# Altium project UZ_CarrierBoard.PrjPcb (part 9 of 10)

## Sheet I2C_Subsystems.SchDoc
size A4; Organization: UltraZohm; SheetNumber: 14
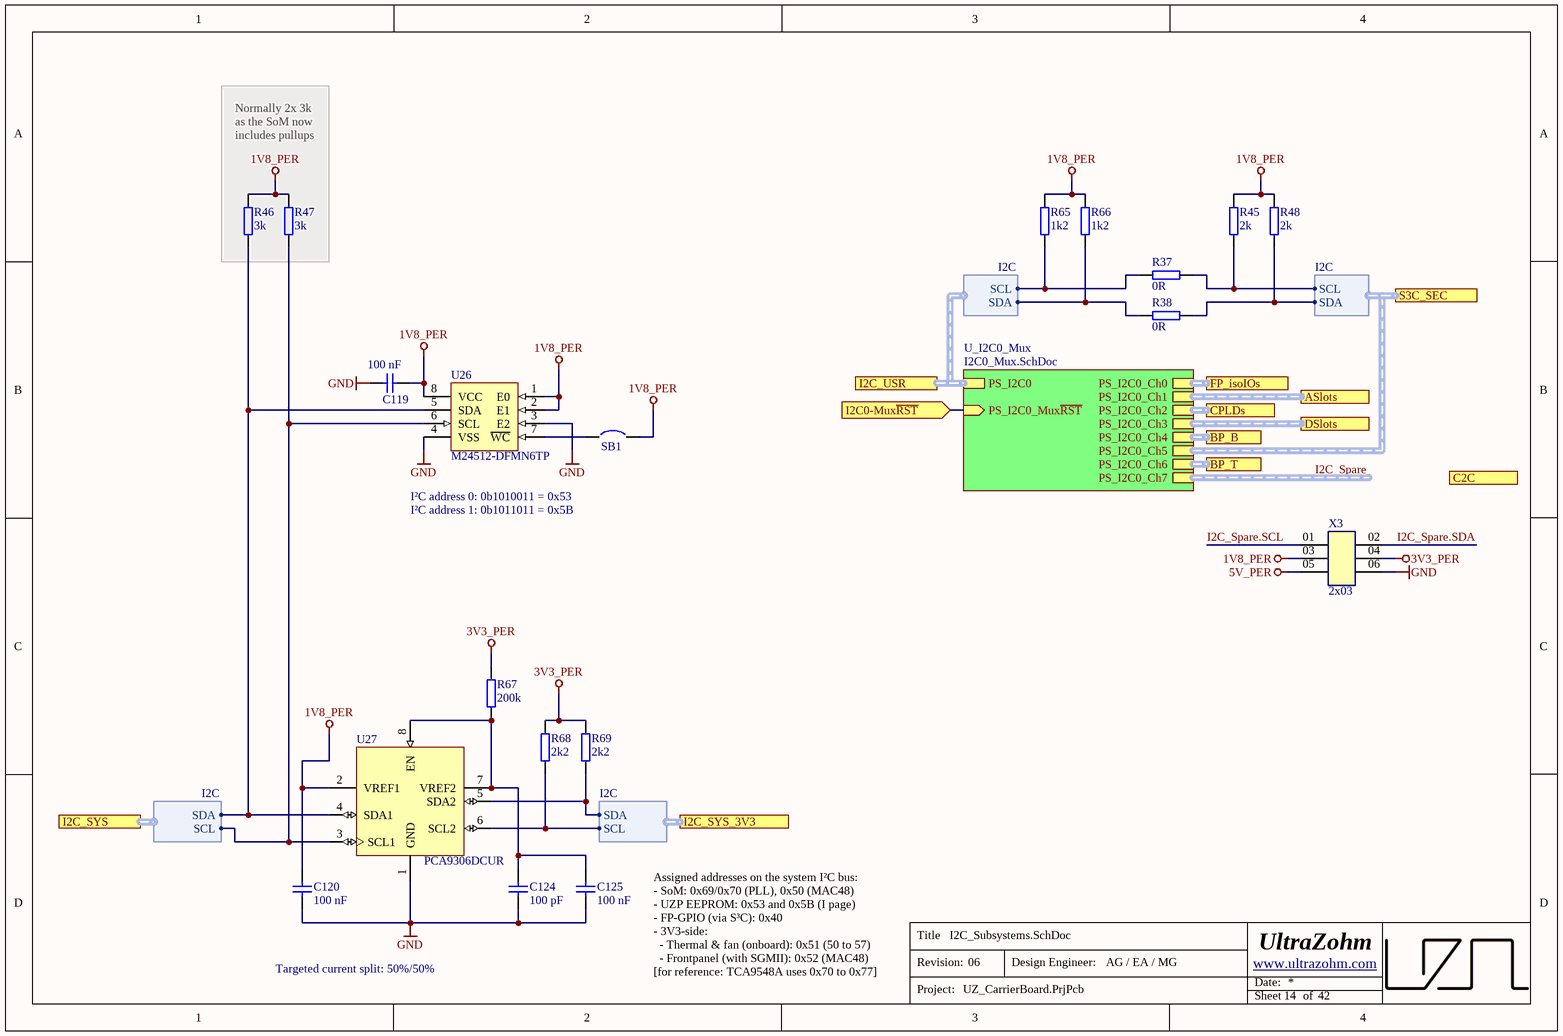
[diagram p36: I2C_Subsystems.SchDoc]

### Parts
C119  100 nF  [C_0603_TE]
C120  100 nF  [C_0603_TE]
C124  100 pF  [C_0603_TE]
C125  100 nF  [C_0603_TE]
R37  0R  [R_0603_TE]
R38  0R  [R_0603_TE]
R45  2k  [R_0603_TE]
R46  3k  [R_0603_TE]
R47  3k  [R_0603_TE]
R48  2k  [R_0603_TE]
R65  1k2  [R_0603_TE]
R66  1k2  [R_0603_TE]
R67  200k  [R_0603_TE]
R68  2k2  [R_0603_TE]
R69  2k2  [R_0603_TE]
SB1  Solder Bump 0603  [SB_0603]  (value not drawn)  (no BOM)
U26  M24512-DFMN6TP  [D0008A_N]
U27  PCA9306DCUR  [FP-DCU0008A-IPC_B]
X3  Pin Layout: 2x03  [TSM-103-01-L-DV]  (hidden comment: PH 0.1" SMD 2x03)

### Sub-sheets
U_I2C0_Mux = I2C0_Mux.SchDoc: PS_I2C0 (harness I2C), PS_I2C0_Mux~{RST} (in), PS_I2C0_Ch0 (harness I2C), PS_I2C0_Ch1 (harness I2C), PS_I2C0_Ch2 (harness I2C), PS_I2C0_Ch3 (harness I2C), PS_I2C0_Ch4 (harness I2C), PS_I2C0_Ch5 (harness I2C), PS_I2C0_Ch6 (harness I2C), PS_I2C0_Ch7 (harness I2C)

### Ports
ASlots (harness I2C), BP_B (harness I2C), BP_T (harness I2C), C2C (harness I2C), CPLDs (harness I2C), DSlots (harness I2C), FP_isoIOs (harness I2C), I2C0-Mux~{RST} (in), I2C_SYS (harness I2C), I2C_SYS_3V3 (harness I2C), I2C_USR (harness I2C), S3C_SEC (harness I2C)

### Harnesses
I2C: SCL, SDA

### Nets
1V8_PER: C119.2 C120.2 R45.2 R46.2 R47.2 R48.2 R65.2 R66.2 SB1.2 U26.1(E0) U26.2(E1) U26.8(VCC) U27.2(VREF1) X3.03
3V3_PER: R67.2 R68.2 R69.2 X3.04
5V_PER: X3.05
GND: C119.1 C120.1 C124.1 C125.1 U26.3(E2) U26.4(VSS) U27.1(GND) X3.06
I2C0-Mux~{RST}: port I2C0-Mux~{RST}, sheet U_I2C0_Mux/PS_I2C0_Mux~{RST}
I2C_Spare.SCL: X3.01
I2C_Spare.SDA: X3.02
PS_I2C0_SCL: R37.1 R65.1 ; port I2C_USR.SCL
PS_I2C0_SDA: R38.1 R66.1 ; port I2C_USR.SDA
PS_I2C1_SCL: R47.1 U26.6(SCL) U27.3(SCL1) ; port I2C_SYS.SCL
PS_I2C1_SDA: R46.1 U26.5(SDA) U27.4(SDA1) ; port I2C_SYS.SDA
NetC124_2: C124.2 C125.2 R67.1 U27.7(VREF2) U27.8(EN)
NetR37_2: R37.2 R45.1 ; port S3C_SEC.SCL
NetR37A_1: R68.1 U27.6(SCL2) ; port I2C_SYS_3V3.SCL
NetR38_2: R38.2 R48.1 ; port S3C_SEC.SDA
NetR38A_1: R69.1 U27.5(SDA2) ; port I2C_SYS_3V3.SDA
NetSB1_1: SB1.1 U26.7(~{WC})

### Buses and harness runs
harness I2C_Spare = sheet U_I2C0_Mux/PS_I2C0_Ch7
harness port ASlots = sheet U_I2C0_Mux/PS_I2C0_Ch1
harness port BP_B = sheet U_I2C0_Mux/PS_I2C0_Ch4
harness port BP_T = sheet U_I2C0_Mux/PS_I2C0_Ch6
harness port CPLDs = sheet U_I2C0_Mux/PS_I2C0_Ch2
harness port DSlots = sheet U_I2C0_Mux/PS_I2C0_Ch3
harness port FP_isoIOs = sheet U_I2C0_Mux/PS_I2C0_Ch0
harness port I2C_USR = sheet U_I2C0_Mux/PS_I2C0
harness port S3C_SEC = sheet U_I2C0_Mux/PS_I2C0_Ch5

### Notes on the sheet
- Normally 2x 3k as the SoM now includes pullups
- I²C address 0: 0b1010011 = 0x53
- I²C address 1: 0b1011011 = 0x5B
- Targeted current split: 50%/50%
- Assigned addresses on the system I²C bus:
  - SoM: 0x69/0x70 (PLL), 0x50 (MAC48)
  - UZP EEPROM: 0x53 and 0x5B (I page)
  - FP-GPIO (via S³C): 0x40
  - 3V3-side:
  - Thermal & fan (onboard): 0x51 (50 to 57)
  - Frontpanel (with SGMII): 0x52 (MAC48)
  [for reference: TCA9548A uses 0x70 to 0x77]
- Title
- Revision:
- Design Engineer:
- Date:
- Project:
- Sheet
- of

### Library data of the parts
C119 C120 C125 = UZgen_C_0603_100nF_50V_X7R: Generic capacitor; Manufacturer: UZgen; Voltage: 50V; Tolerance: 10 %; Created from: AGeiger; Manufacturer Part Number: UZgen_C_0603_100nF_50V_X7R; PartID: 1; Created On: 02/07/2024 14:42:23; Value: 100 nF; Device Package: 0603; Technology: X7R; Mounting Type: SMD; Last Updated: 08/08/2024 15:01:15
C124 = UZgen_C_0603_100pF_50V_X7R: Generic capacitor; Manufacturer: UZgen; Voltage: 50V; Tolerance: 10 %; Created from: UZgenTool; Manufacturer Part Number: UZgen_C_0603_100pF_50V_X7R; PartID: 4215; Created On: 02/08/2024 11:18:08; Value: 100 pF; Device Package: 0603; Technology: X7R; Mounting Type: SMD; Last Updated: 02/08/2024 11:18:08
R37 R38 = UZgen_R_0603_0R: Generic resistor; Manufacturer: UZgen; Tolerance: 1 %; Created from: UZgenTool; Manufacturer Part Number: UZgen_R_0603_0R; PartID: 581; Created On: 08/07/2024 14:34:30; Value: 0R; Device Package: 0603; Mounting Type: SMD; Last Updated: 08/07/2024 14:34:30
R45 R48 = UZgen_R_0603_2k: Generic resistor; Manufacturer: UZgen; Tolerance: 1 %; Created from: UZgenTool; Manufacturer Part Number: UZgen_R_0603_2k; PartID: 228; Created On: 02/07/2024 17:29:49; Value: 2k; Device Package: 0603; Mounting Type: SMD; Last Updated: 02/07/2024 17:29:49
R46 R47 = UZgen_R_0603_3k: Generic resistor; Manufacturer: UZgen; Tolerance: 1 %; Created from: UZgenTool; Manufacturer Part Number: UZgen_R_0603_3k; PartID: 232; Created On: 02/07/2024 17:29:49; Value: 3k; Device Package: 0603; Mounting Type: SMD; Last Updated: 02/07/2024 17:29:49
R65 R66 = UZgen_R_0603_1k2: Generic resistor; Manufacturer: UZgen; Tolerance: 1 %; Created from: UZgenTool; Manufacturer Part Number: UZgen_R_0603_1k2; PartID: 223; Created On: 02/07/2024 17:29:49; Value: 1k2; Device Package: 0603; Mounting Type: SMD; Last Updated: 02/07/2024 17:29:49
R67 = UZgen_R_0603_200k: Generic resistor; Manufacturer: UZgen; Tolerance: 1 %; Created from: UZgenTool; Manufacturer Part Number: UZgen_R_0603_200k; PartID: 275; Created On: 02/07/2024 17:29:50; Value: 200k; Device Package: 0603; Mounting Type: SMD; Last Updated: 02/07/2024 17:29:50
R68 R69 = UZgen_R_0603_2k2: Generic resistor; Manufacturer: UZgen; Tolerance: 1 %; Created from: UZgenTool; Manufacturer Part Number: UZgen_R_0603_2k2; PartID: 229; Created On: 02/07/2024 17:29:49; Value: 2k2; Device Package: 0603; Mounting Type: SMD; Last Updated: 02/07/2024 17:29:49
SB1 = =Value: Created from: AGeiger; Revision: July-2002: Re-released for DXP Platform.; Manufacturer Part Number: Solder Bump 0603; PartID: 1; Created On: 09/01/2024 17:13:56; Component Type: Solder Bump; Device Package: 0603; Last Updated: 09/01/2024 17:13:56; Mounting Type: SMD; Value: Solder Bump 0603
U26 = M24512-DFMN6TP: 512Kbit 1MHz I2C SOP-8 EEPROM ROHS; Manufacturer: STMicroelectronics; Created from: FRosner; Manufacturer Part Number: M24512-DFMN6TP; PartID: 6; Created On: 07/09/2024 12:11:36; ComponentLink1Description: Datasheet; ComponentLink1URL: https://wmsc.lcsc.com/wmsc/upload/file/pdf/v2/lcsc/2304140030_STMicroelectronics-M24512-DFMN6TP_C222090.pdf; Component Type: EEPROM; Device Package: SOP-8; Last Updated: 07/09/2024 12:18:21; Mounting Type: SMD; Operating Temperature: -40 to +85 °C; Series: M24xxx; Supplier 1: Mouser; Supplier Part Number 1: 511-M24512-DFMN6TP; Supplier 2: LCSC; Supplier Part Number 2: C222090; Type: Memory; Value: M24512-DFMN6TP; LCSC Part Number: C222090
U27 = PCA9306DCUR: Translation - Voltage Levels Dual BiDir I2C-Bus & SMBus Vltg Lvl-Trans; Manufacturer: Texas Instruments; Created from: FRosner; Manufacturer Part Number: PCA9306DCUR; PartID: 3; Created On: 28/06/2024 14:17:50; ComponentLink1Description: Datasheet; ComponentLink1URL: https://www.ti.com/lit/ds/symlink/pca9306.pdf?ts=1719580405392&ref_url=https%253A%252F%252Fwww.mouser.de%252F; Component Type: Translation - Voltage Levels; Device Package: VSSOP-8; Last Updated: 11/07/2024 13:33:56; Mounting Type: SMD; Supplier 1: Mouser; Supplier Part Number 1: 595-PCA9306DCUR; Supplier 2: LCSC; Supplier Part Number 2: C33196; Type: Bidirectional Voltage Level Translator; Live Cycle Status: 1; LCSC Part Number: C33196; Stock number: not stored
X3 = UZgen_Conn_PinHead_2x03_SMD_100mil_90deg: 0.1" Double-row Pin Header, 90°-to-PCB SMD, 2x03 Pins, 250V, 3A; Manufacturer: UZgen; Pin Pitch: 0.1" x 0.1"; Pin Orientation: 90° (standing); Created from: UZgenTool; Manufacturer Part Number: UZgen_Conn_PinHead_2x03_SMD_100mil_90deg; PartID: 2; Created On: 18/02/2025 11:27:30; Value: PH 0.1" SMD 2x03; Device Package: SMD 0.1" 2x03; Pin Count: 6; Pin Voltage: 250V; Pin Current: 3A; Mounting Type: SMD; Last Updated: 18/02/2025 11:27:30

## Sheet I2C0_Mux.SchDoc
size A4; Organization: UltraZohm; SheetNumber: 15
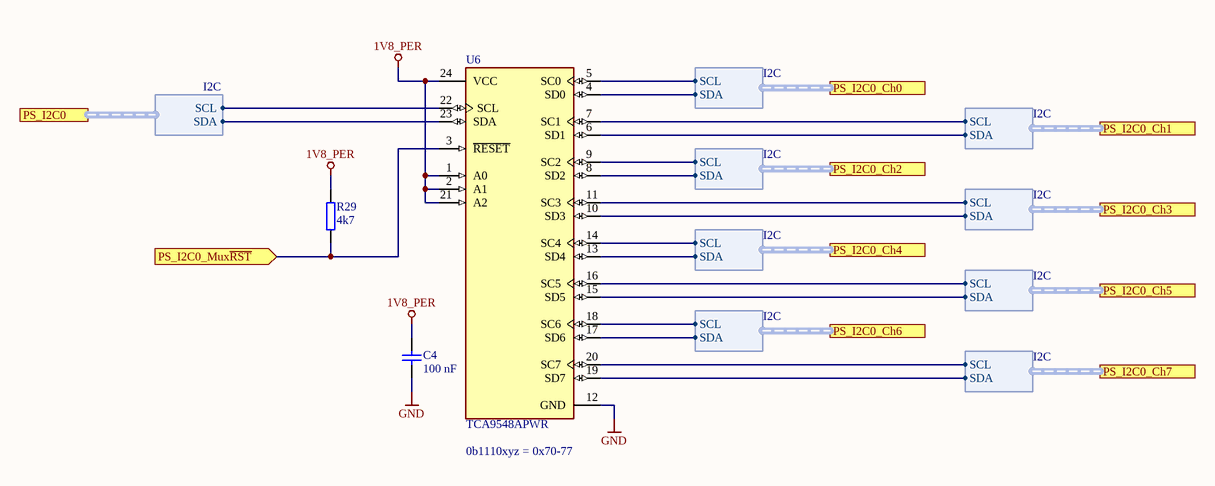
[diagram p37: I2C0_Mux.SchDoc]

### Parts
C4  100 nF  [C_0603_TE]
R29  4k7  [R_0603_TE]
U6  TCA9548APWR  [FP-PW0024A-IPC_A]

### Ports
PS_I2C0 (harness I2C), PS_I2C0_Ch0 (harness I2C), PS_I2C0_Ch1 (harness I2C), PS_I2C0_Ch2 (harness I2C), PS_I2C0_Ch3 (harness I2C), PS_I2C0_Ch4 (harness I2C), PS_I2C0_Ch5 (harness I2C), PS_I2C0_Ch6 (harness I2C), PS_I2C0_Ch7 (harness I2C), PS_I2C0_Mux~{RST} (in)

### Harnesses
I2C: SCL, SDA

### Nets
1V8_PER: C4.2 R29.2 U6.1(A0) U6.2(A1) U6.21(A2) U6.24(VCC)
GND: C4.1 U6.12(GND)
ASlots_SCL_3V3: U6.7(SC1) ; port PS_I2C0_Ch1.SCL
ASlots_SDA_3V3: U6.6(SD1) ; port PS_I2C0_Ch1.SDA
CPLDs_SCL_1V8: U6.9(SC2) ; port PS_I2C0_Ch2.SCL
CPLDs_SDA_1V8: U6.8(SD2) ; port PS_I2C0_Ch2.SDA
DSlots_SCL_3V3: U6.11(SC3) ; port PS_I2C0_Ch3.SCL
DSlots_SDA_3V3: U6.10(SD3) ; port PS_I2C0_Ch3.SDA
I2C0-Mux~{RST}: R29.1 U6.3(~{RESET}) ; port PS_I2C0_Mux~{RST}
I2C_Spare.SCL: U6.20(SC7) ; port PS_I2C0_Ch7.SCL
I2C_Spare.SDA: U6.19(SD7) ; port PS_I2C0_Ch7.SDA
PS_I2C0_SCL: U6.22(SCL) ; port PS_I2C0.SCL
PS_I2C0_SDA: U6.23(SDA) ; port PS_I2C0.SDA
NetR37_2: U6.16(SC5) ; port PS_I2C0_Ch5.SCL
NetR38_2: U6.15(SD5) ; port PS_I2C0_Ch5.SDA
NetU6_4: U6.4(SD0) ; port PS_I2C0_Ch0.SDA
NetU6_5: U6.5(SC0) ; port PS_I2C0_Ch0.SCL
NetU6_13: U6.13(SD4) ; port PS_I2C0_Ch4.SDA
NetU6_14: U6.14(SC4) ; port PS_I2C0_Ch4.SCL
NetU6_17: U6.17(SD6) ; port PS_I2C0_Ch6.SDA
NetU6_18: U6.18(SC6) ; port PS_I2C0_Ch6.SCL

### Notes on the sheet
- (near U6) 0b1110xyz = 0x70-77
- Title
- Revision:
- Design Engineer:
- Date:
- Project:
- Sheet
- of

### Library data of the parts
C4 = UZgen_C_0603_100nF_50V_X7R: Generic capacitor; Manufacturer: UZgen; Voltage: 50 V; Tolerance: 10 %; Created from: AGeiger; Manufacturer Part Number: UZgen_C_0603_100nF_50V_X7R; PartID: 1; Created On: 02/07/2024 14:42:23; Value: 100 nF; Device Package: 0603; Technology: X7R; Mounting Type: SMD; Last Updated: 02/08/2024 14:45:57
R29 = UZgen_R_0603_4k7: Generic resistor; Manufacturer: UZgen; Tolerance: 1 %; Created from: UZgenTool; Manufacturer Part Number: UZgen_R_0603_4k7; PartID: 237; Created On: 02/07/2024 17:29:50; Value: 4k7; Device Package: 0603; Mounting Type: SMD; Last Updated: 02/07/2024 17:29:50
U6 = TCA9548APWR: Switch ICs - Various 8-Channel I2C Switch; Manufacturer: Texas Instruments; Created from: FRosner; ComponentLink2Description: Datasheet; ComponentLink2URL: http://www.ti.com/lit/ds/symlink/tca9548a.pdf; Manufacturer Part Number: TCA9548APWR; PartID: 35; Created On: 13/06/2024 10:28:56; ComponentLink1Description: Datasheet; ComponentLink1URL: https://www.ti.com/lit/ds/symlink/tca9548a.pdf; Component Type: 8-Channel I2C Switch; Device Package: TSSOP-24; Last Updated: 08/07/2024 12:56:02; Mounting Type: SMD/SMT; Operating Temperature: -40°C - +85°C; Series: TCA9548; Supplier 1: Mouser; Supplier Part Number 1: 595-TCA9548APWR; Supplier 2: LCSC; Supplier Part Number 2: C130026; Type: Switch ICs - Various; Value: TCA9548APWR; Live Cycle Status: 1; LCSC Part Number: C130026

## Sheet Backpanel.SchDoc
size A4; Organization: UltraZohm; SheetNumber: 37
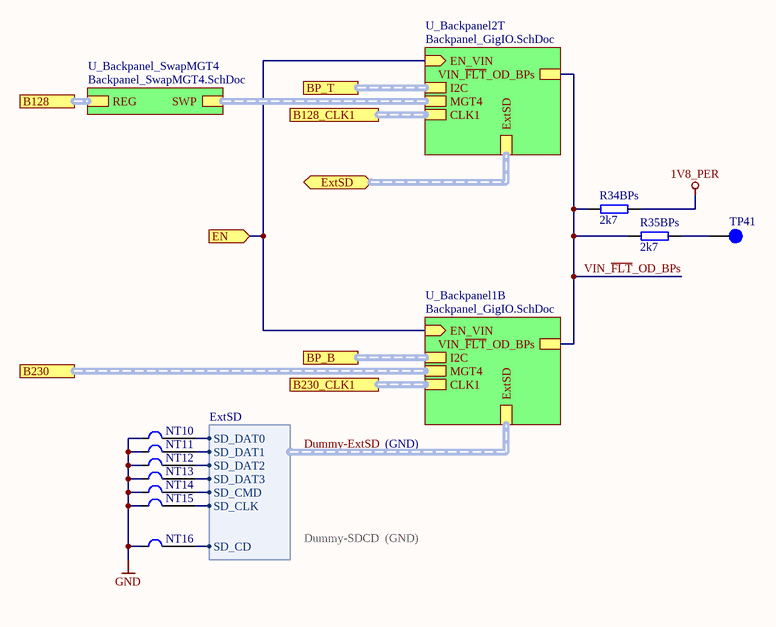
[diagram p38: Backpanel.SchDoc]

### Parts
NT10  Net Tie 1 to 1  [1_to_1_NetTie_0.1mm]  (value not drawn)  (net tie, no BOM)
NT11  Net Tie 1 to 1  [1_to_1_NetTie_0.1mm]  (value not drawn)  (net tie, no BOM)
NT12  Net Tie 1 to 1  [1_to_1_NetTie_0.1mm]  (value not drawn)  (net tie, no BOM)
NT13  Net Tie 1 to 1  [1_to_1_NetTie_0.1mm]  (value not drawn)  (net tie, no BOM)
NT14  Net Tie 1 to 1  [1_to_1_NetTie_0.1mm]  (value not drawn)  (net tie, no BOM)
NT15  Net Tie 1 to 1  [1_to_1_NetTie_0.1mm]  (value not drawn)  (net tie, no BOM)
NT16  Net Tie 1 to 1  [1_to_1_NetTie_0.1mm]  (value not drawn)  (net tie, no BOM)
R34BPs  2k7  [R_0603_TE]
R35BPs  2k7  [R_0603_TE]
TP41  Testpoint 1mm  [TP_1mm]  (value not drawn)  (no BOM)

### Sub-sheets
U_Backpanel1B = Backpanel_GigIO.SchDoc: EN_VIN (in), I2C (harness I2C), MGT4 (harness MGT4), CLK1 (harness MGTCLK), VIN_~{FLT}_OD_BPs, ExtSD (harness ExtSD)
U_Backpanel2T = Backpanel_GigIO.SchDoc: EN_VIN (in), I2C (harness I2C), MGT4 (harness MGT4), CLK1 (harness MGTCLK), VIN_~{FLT}_OD_BPs, ExtSD (harness ExtSD)
U_Backpanel_SwapMGT4 = Backpanel_SwapMGT4.SchDoc: REG (harness MGT4), SWP (harness MGT4)

### Ports
B128 (harness MGT4), B128_CLK1 (harness MGTCLK), B230 (harness MGT4), B230_CLK1 (harness MGTCLK), BP_B (harness I2C), BP_T (harness I2C), EN (in), ExtSD (bidir, harness ExtSD)

### Harnesses
ExtSD: SD_DAT0, SD_DAT1, SD_DAT2, SD_DAT3, SD_CMD, SD_CLK, SD_CD

### Nets
1V8_PER: R34BPs.2
GND: NT10.1 NT11.1 NT12.1 NT13.1 NT14.1 NT15.1 NT16.1
Dummy-ExtSD.SD_CD: NT16.2 ; sheet U_Backpanel1B/ExtSD.SD_CD
Dummy-ExtSD.SD_CLK: NT15.2 ; sheet U_Backpanel1B/ExtSD.SD_CLK
Dummy-ExtSD.SD_CMD: NT14.2 ; sheet U_Backpanel1B/ExtSD.SD_CMD
Dummy-ExtSD.SD_DAT0: NT10.2 ; sheet U_Backpanel1B/ExtSD.SD_DAT0
Dummy-ExtSD.SD_DAT1: NT11.2 ; sheet U_Backpanel1B/ExtSD.SD_DAT1
Dummy-ExtSD.SD_DAT2: NT12.2 ; sheet U_Backpanel1B/ExtSD.SD_DAT2
Dummy-ExtSD.SD_DAT3: NT13.2 ; sheet U_Backpanel1B/ExtSD.SD_DAT3
RailEn: port EN, sheet U_Backpanel2T/EN_VIN, sheet U_Backpanel1B/EN_VIN
VIN_~{FLT}_OD_BPs: R34BPs.1 R35BPs.1 ; sheet U_Backpanel2T/VIN_~{FLT}_OD_BPs, sheet U_Backpanel1B/VIN_~{FLT}_OD_BPs
NetR35BPs_2: R35BPs.2 TP41.1

### Buses and harness runs
harness Dummy-ExtSD = sheet U_Backpanel1B/ExtSD
harness port B128 = sheet U_Backpanel_SwapMGT4/REG
harness port B128_CLK1 = sheet U_Backpanel2T/CLK1
harness port B230 = sheet U_Backpanel1B/MGT4
harness port B230_CLK1 = sheet U_Backpanel1B/CLK1
harness port BP_B = sheet U_Backpanel1B/I2C
harness port BP_T = sheet U_Backpanel2T/I2C
harness port ExtSD = sheet U_Backpanel2T/ExtSD
harness sheet U_Backpanel2T/MGT4 = sheet U_Backpanel_SwapMGT4/SWP

### Notes on the sheet
- (GND)
- Dummy-SDCD
- Title
- Revision:
- Design Engineer:
- Date:
- Project:
- Sheet
- of

### Library data of the parts
NT10-NT16 = Net Tie 1 to 1: Net Tie 1 to 1. Joins two nets without producing a DRC error or renaming one of the nets; PartID: 2; Created On: 29/09/2024 15:25:00; Component Type: Net Tie 1 to 1; Last Updated: 29/09/2024 15:25:00; Type: Net Tie (No BOM); Created by: MGeier; Live Cycle Status: 1
R34BPs R35BPs = UZgen_R_0603_2k7: Generic resistor; Manufacturer: UZgen; Tolerance: 1 %; Created from: UZgenTool; Manufacturer Part Number: UZgen_R_0603_2k7; PartID: 231; Created On: 02/07/2024 17:29:49; Value: 2k7; Device Package: 0603; Mounting Type: SMD; Last Updated: 02/07/2024 17:29:49
TP41 = NULL: Manufacturer Part Number: NULL; Created from: AGeiger; Created: 2018_06_25_AGeiger; Value: Testpoint 1mm; PartID: 9; Created On: 20/09/2022 13:14:57; Component Type: Testpoint; Last Updated: 20/09/2022 13:15:39; Manufacturer: NULL; Supplier 1: NULL; Supplier Part Number 1: NULL; Type: Testpoint; Live Cycle Status: 1

## Sheet Backpanel_GigIO.SchDoc
size A4; Organization: UltraZohm; SheetNumber: 39
Used 2 times, as channels U_Backpanel/U_Backpanel2T, U_Backpanel/U_Backpanel1B. Parts and nets are listed once, with the designators drawn on the sheet.
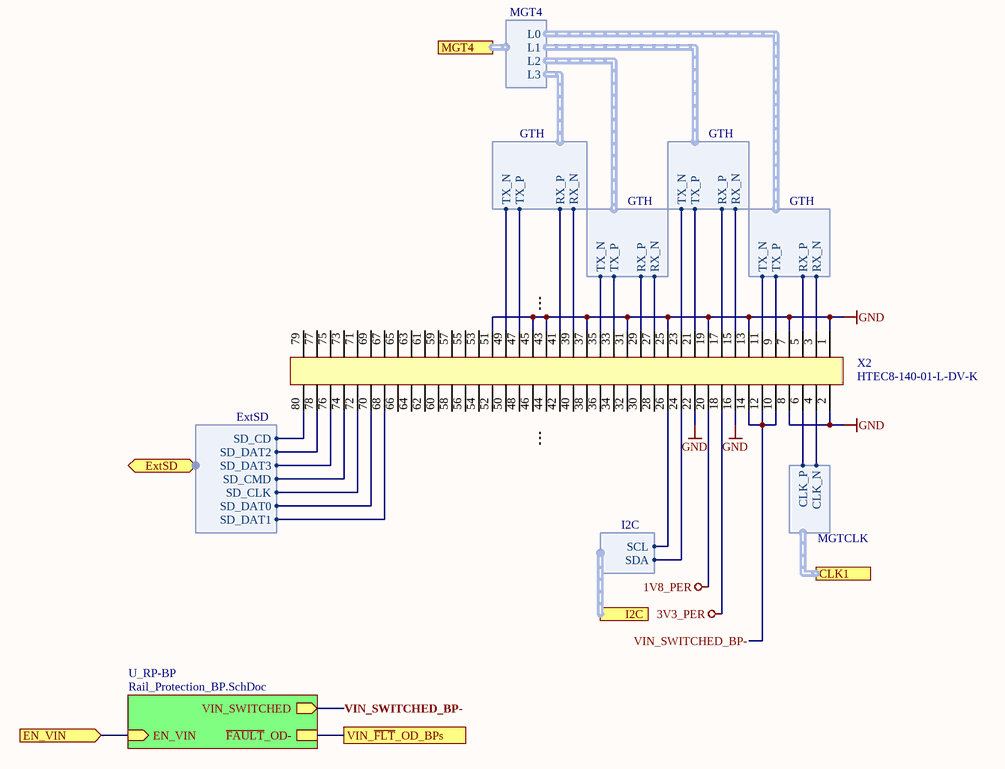
[diagram p39: Backpanel_GigIO.SchDoc]

### Parts
X2  HTEC8-140-01-L-DV-K  [HTEC8-140-XX-X-DV]

### Sub-sheets
U_RP-BP = Rail_Protection_BP.SchDoc: EN_VIN (in), VIN_SWITCHED (out), ~{FAULT}_OD-

### Ports
CLK1 (harness MGTCLK), EN_VIN (in), ExtSD (bidir, harness ExtSD), I2C (harness I2C), MGT4 (harness MGT4), VIN_~{FLT}_OD_BPs

### Harnesses
I2C: SCL, SDA
MGT4: L0, L1, L2, L3
MGTCLK: CLK_N, CLK_P
GTH: RX_N, RX_P, TX_N, TX_P
ExtSD: SD_DAT0, SD_DAT1, SD_DAT2, SD_DAT3, SD_CMD, SD_CLK, SD_CD

### Nets
1V8_PER: X2.20
3V3_PER: X2.18
GND: X2.1 X2.2 X2.7 X2.8 X2.13 X2.16 X2.19 X2.22 X2.25 X2.31 X2.37 X2.43 X2.45 X2.51
EN_VIN: port EN_VIN, sheet U_RP-BP/EN_VIN
VIN_~{FLT}_OD_BPs: port VIN_~{FLT}_OD_BPs, sheet U_RP-BP/~{FAULT}_OD-
VIN_SWITCHED_BP-: X2.10 X2.12 X2.14 ; sheet U_RP-BP/VIN_SWITCHED
NetX2_3: X2.3 ; harness GTH.RX_N
NetX2_4: X2.4 ; port CLK1.CLK_N
NetX2_5: X2.5 ; harness GTH.RX_P
NetX2_6: X2.6 ; port CLK1.CLK_P
NetX2_9: X2.9 ; harness GTH.TX_P
NetX2_11: X2.11 ; harness GTH.TX_N
NetX2_15: X2.15 ; harness GTH.RX_N
NetX2_17: X2.17 ; harness GTH.RX_P
NetX2_21: X2.21 ; harness GTH.TX_P
NetX2_23: X2.23 ; harness GTH.TX_N
NetX2_24: X2.24 ; port I2C.SDA
NetX2_26: X2.26 ; port I2C.SCL
NetX2_27: X2.27 ; harness GTH.RX_N
NetX2_29: X2.29 ; harness GTH.RX_P
NetX2_33: X2.33 ; harness GTH.TX_P
NetX2_35: X2.35 ; harness GTH.TX_N
NetX2_39: X2.39 ; harness GTH.RX_N
NetX2_41: X2.41 ; harness GTH.RX_P
NetX2_47: X2.47 ; harness GTH.TX_P
NetX2_49: X2.49 ; harness GTH.TX_N
NetX2_68: X2.68 ; port ExtSD.SD_DAT1
NetX2_70: X2.70 ; port ExtSD.SD_DAT0
NetX2_72: X2.72 ; port ExtSD.SD_CLK
NetX2_74: X2.74 ; port ExtSD.SD_CMD
NetX2_76: X2.76 ; port ExtSD.SD_DAT3
NetX2_78: X2.78 ; port ExtSD.SD_DAT2
NetX2_80: X2.80 ; port ExtSD.SD_CD

Not connected (* = marked no-connect by the designer): X2 28 30 32 34 36 38 40 42 44 46 48 50 52 53 54 55 56 57 58 59 60 61 62 63 64 65 66 67 69 71 73 75 77 79

### Channels
U_Backpanel/U_Backpanel2T: designators end in A; ports EN_VIN=RailEn VIN_~{FLT}_OD_BPs=VIN_~{FLT}_OD_BPs
U_Backpanel/U_Backpanel1B: designators end in B; ports EN_VIN=RailEn VIN_~{FLT}_OD_BPs=VIN_~{FLT}_OD_BPs

### Notes on the sheet
- Title
- Revision:
- Design Engineer:
- Date:
- Project:
- Sheet
- of

### Library data of the parts
X2 = HTEC8-140-01-L-DV-K: Headers & Wire Housings 0.80 mm Rugged High-Speed Edge Card Connectors; Manufacturer: SAMTEC; Created from: AGeiger; Number of positions: 80; Manufacturer Part Number: HTEC8-140-01-L-DV-K; PartID: 23; Created On: 07/06/2024 14:27:34; ComponentLink1Description: Datasheet; ComponentLink1URL: https://suddendocs.samtec.com/catalog_english/htec8.pdf; Component Type: Board to Board Connector; Device Package: SMD; Last Updated: 09/07/2024 10:19:13; Mounting Type: SMD; Series: HTEC8; Supplier 1: SAMTEC; Supplier Part Number 1: HTEC8-140-01-L-DV-K; Type: Board to Board Connector; Live Cycle Status: 1; LCSC Part Number: C20365608; Stock number: not stored; Number of rows: 2

## Sheet Rail_Protection_BP.SchDoc
size A4; Organization: UltraZohm; SheetNumber: 40BP
Used 2 times, as channels U_Backpanel/U_Backpanel2T/U_RP-BP, U_Backpanel/U_Backpanel1B/U_RP-BP. Parts and nets are listed once, with the designators drawn on the sheet.
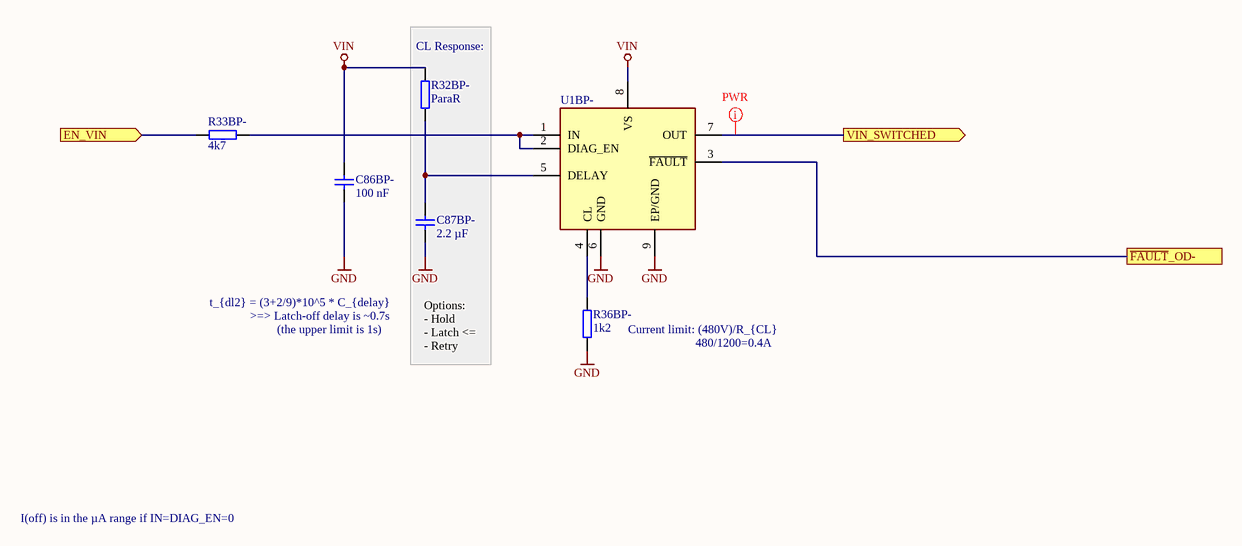
[diagram p40: Rail_Protection_BP.SchDoc]

### Parts
C86BP-  100 nF  [C_0603_TE]
C87BP-  2.2 µF  [C_0603_TE]
R32BP-  ParaR  [R_0603_TE]
R33BP-  4k7  [R_0603_TE]
R36BP-  1k2  [R_0603_TE]
U1BP-  TPS1H000AQDGNRQ1  [SOP65P490X110-9N]  (value not drawn)

### Blocks framed on the sheet
CL Response:: C87BP- R32BP-

### Ports
EN_VIN (in), VIN_SWITCHED (out), ~{FAULT}_OD-

### Nets
GND: C86BP-.1 C87BP-.1 R36BP-.1 U1BP-.6(GND) U1BP-.9(EP/GND)
VIN: C86BP-.2 R32BP-.2 U1BP-.8(VS)
EN_VIN: R33BP-.1 ; port EN_VIN
~{FAULT}_OD-: U1BP-.3(~{FAULT}) ; port ~{FAULT}_OD-
VIN_SWITCHED: U1BP-.7(OUT) ; port VIN_SWITCHED
NetC87BP-_2: C87BP-.2 R32BP-.1 U1BP-.5(DELAY)
NetR33BP-_2: R33BP-.2 U1BP-.1(IN) U1BP-.2(DIAG_EN)
NetR36BP-_2: R36BP-.2 U1BP-.4(CL)

### Channels
U_Backpanel/U_Backpanel2T/U_RP-BP: designators end in A; ports EN_VIN=RailEn VIN_SWITCHED=VIN_SWITCHED_BP-_U_Backpanel2T ~{FAULT}_OD-=VIN_~{FLT}_OD_BPs
U_Backpanel/U_Backpanel1B/U_RP-BP: designators end in B; ports EN_VIN=RailEn VIN_SWITCHED=VIN_SWITCHED_BP-_U_Backpanel1B ~{FAULT}_OD-=VIN_~{FLT}_OD_BPs

### Layout directives
net class PWR: VIN_SWITCHED_BP-_U_Backpanel2T

### Notes on the sheet
- t_{dl2} = (3+2/9)*10^5 * C_{delay}
- >=> Latch-off delay is ~0.7s
- (the upper limit is 1s)
- Options:
  - Hold
  - Latch <=
  - Retry
- (near R36BP-) Current limit: (480V)/R_{CL}
- 480/1200=0.4A
- I(off) is in the µA range if IN=DIAG_EN=0
- Title
- Revision:
- Design Engineer:
- Date:
- Project:
- Sheet
- of

### Library data of the parts
C86BP- = UZgen_C_0603_100nF_50V_X7R: as C119 on sheet I2C_Subsystems; Manufacturer Part Number: UZgen_C_0603_100nF_50V_X7R; PartID: 1; Created On: 02/07/2024 14:42:23; Value: 100 nF; Device Package: 0603; Technology: X7R; Mounting Type: SMD; Last Updated: 08/08/2024 15:01:15
C87BP- = UZgen_C_0603_2.2uF_50V_X7R: Generic capacitor; Manufacturer: UZgen; Voltage: 50V; Tolerance: 10 %; Created from: UZgenTool; Manufacturer Part Number: UZgen_C_0603_2.2uF_50V_X7R; PartID: 4317; Created On: 02/08/2024 11:18:10; Value: 2.2 µF; Device Package: 0603; Technology: X7R; Mounting Type: SMD; Last Updated: 02/08/2024 11:18:10
R32BP- = UZgen_R_0603_ParaR: Generic resistor (parametric); Manufacturer: UZgen; Tolerance: 1 %; Created from: UZgenTool; Manufacturer Part Number: UZgen_R_0603_ParaR; PartID: 588; Created On: 08/07/2024 14:34:30; Value: ParaR; Device Package: 0603; Mounting Type: SMD; Last Updated: 08/07/2024 14:34:30
R33BP- = UZgen_R_0603_4k7: as R29 on sheet I2C0_Mux; Manufacturer Part Number: UZgen_R_0603_4k7; PartID: 237; Created On: 02/07/2024 17:29:50; Value: 4k7; Device Package: 0603; Mounting Type: SMD; Last Updated: 02/07/2024 17:29:50
R36BP- = UZgen_R_0603_1k2: as R65 on sheet I2C_Subsystems; Manufacturer Part Number: UZgen_R_0603_1k2; PartID: 223; Created On: 02/07/2024 17:29:49; Value: 1k2; Device Package: 0603; Mounting Type: SMD; Last Updated: 02/07/2024 17:29:49
U1BP- = TPS1H000AQDGNRQ1: Power Switch ICs - Power Distribution 40-V, 1-ohm, 1-ch automotive smart high-side switch with adjustable current limit 8-HVSSOP -40 to 125; Manufacturer: Texas Instruments; Created from: FRosner; Manufacturer Part Number: TPS1H000AQDGNRQ1; PartID: 7; Created On: 15/07/2024 07:35:11; ComponentLink1Description: Datasheet; ComponentLink1URL: https://www.ti.com/lit/ds/symlink/tps1h000-q1.pdf; Component Type: Power Switch ICs; Device Package: MSOP-PowerPad-8; Last Updated: 11/04/2025 15:13:45; Mounting Type: SMD; Operating Temperature: -40 to +125 °C; Series: TPS1H000-Q1; Supplier 1: Mouser; Supplier Part Number 1: 595-TPS1H000AQDGNRQ1; Supplier 2: LCSC; Supplier Part Number 2: C2653764; Value: TPS1H000AQDGNRQ1; LCSC Part Number: C2653764

## Sheet Backpanel_SwapMGT4.SchDoc
size A4; Organization: UltraZohm; SheetNumber: 38
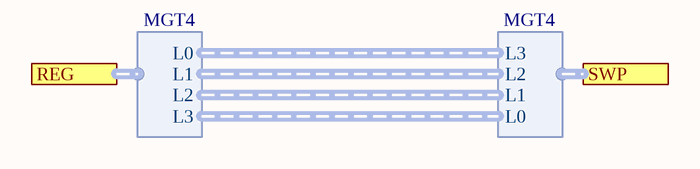
[diagram p41: Backpanel_SwapMGT4.SchDoc]

### Ports
REG (harness MGT4), SWP (harness MGT4)

### Harnesses
MGT4: L0, L1, L2, L3
MGT4: L3, L2, L1, L0

### Notes on the sheet
- Title
- Revision:
- Design Engineer:
- Date:
- Project:
- Sheet
- of